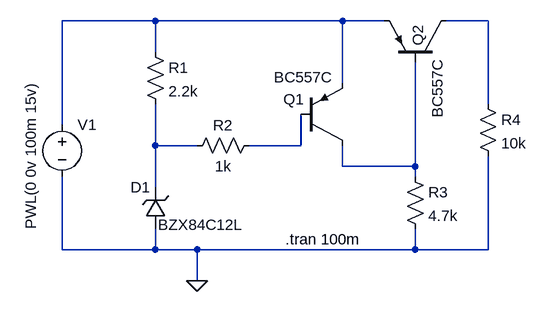
[diagram p0: schematic pnp.asc]
pnp.asc, the LTspice schematic file:
Version 4
SHEET 1 880 680
WIRE 96 -48 -48 -48
WIRE 384 -48 96 -48
WIRE 448 -48 384 -48
WIRE 608 -48 544 -48
WIRE 96 0 96 -48
WIRE 384 48 384 -48
WIRE 608 80 608 -48
WIRE -48 112 -48 -48
WIRE 96 144 96 80
WIRE 160 144 96 144
WIRE 320 144 320 96
WIRE 320 144 240 144
WIRE 384 176 384 144
WIRE 496 176 496 16
WIRE 496 176 384 176
WIRE 496 192 496 176
WIRE 96 208 96 144
WIRE -48 304 -48 192
WIRE 96 304 96 272
WIRE 96 304 -48 304
WIRE 160 304 96 304
WIRE 496 304 496 272
WIRE 496 304 160 304
WIRE 608 304 608 160
WIRE 608 304 496 304
WIRE 160 352 160 304
FLAG 160 352 0
SYMBOL voltage -48 96 R0
WINDOW 3 -48 177 VLeft 2
WINDOW 123 0 0 Left 0
WINDOW 39 0 0 Left 0
SYMATTR InstName V1
SYMATTR Value PWL(0 0v 100m 15v)
SYMBOL res 80 -16 R0
SYMATTR InstName R1
SYMATTR Value 2.2k
SYMBOL res 256 128 R90
WINDOW 0 0 56 VBottom 2
WINDOW 3 32 56 VTop 2
SYMATTR InstName R2
SYMATTR Value 1k
SYMBOL pnp 320 144 M180
WINDOW 0 -27 71 Left 2
WINDOW 3 -42 105 Left 2
SYMATTR InstName Q1
SYMATTR Value BC557C
SYMBOL pnp 544 16 M270
WINDOW 0 25 44 Left 2
WINDOW 3 -86 14 Left 2
SYMATTR InstName Q2
SYMATTR Value BC557C
SYMBOL zener 112 272 R180
WINDOW 0 24 64 Left 2
WINDOW 3 -119 6 Left 2
SYMATTR InstName D1
SYMATTR Value BZX84C12L
SYMATTR Description Diode
SYMATTR Type diode
SYMBOL res 480 176 R0
SYMATTR InstName R3
SYMATTR Value 4.7k
SYMBOL res 592 64 R0
SYMATTR InstName R4
SYMATTR Value 10k
TEXT 296 288 Left 2 !.tran 100m

The netlist it stands for:
* pnp.asc
V1 N001 0 PWL(0 0v 100m 15v)
R1 N001 N003 2.2k
R2 N004 N003 1k
Q1 N005 N004 N001 0 BC557C
Q2 N002 N005 N001 0 BC557C
D1 0 N003 BZX84C12L
R3 N005 0 4.7k
R4 N002 0 10k
.model D D
.lib standard.dio
.model NPN NPN
.model PNP PNP
.lib standard.bjt
.tran 100m
.backanno
.end